# Altium project TeensySound.PrjPcb
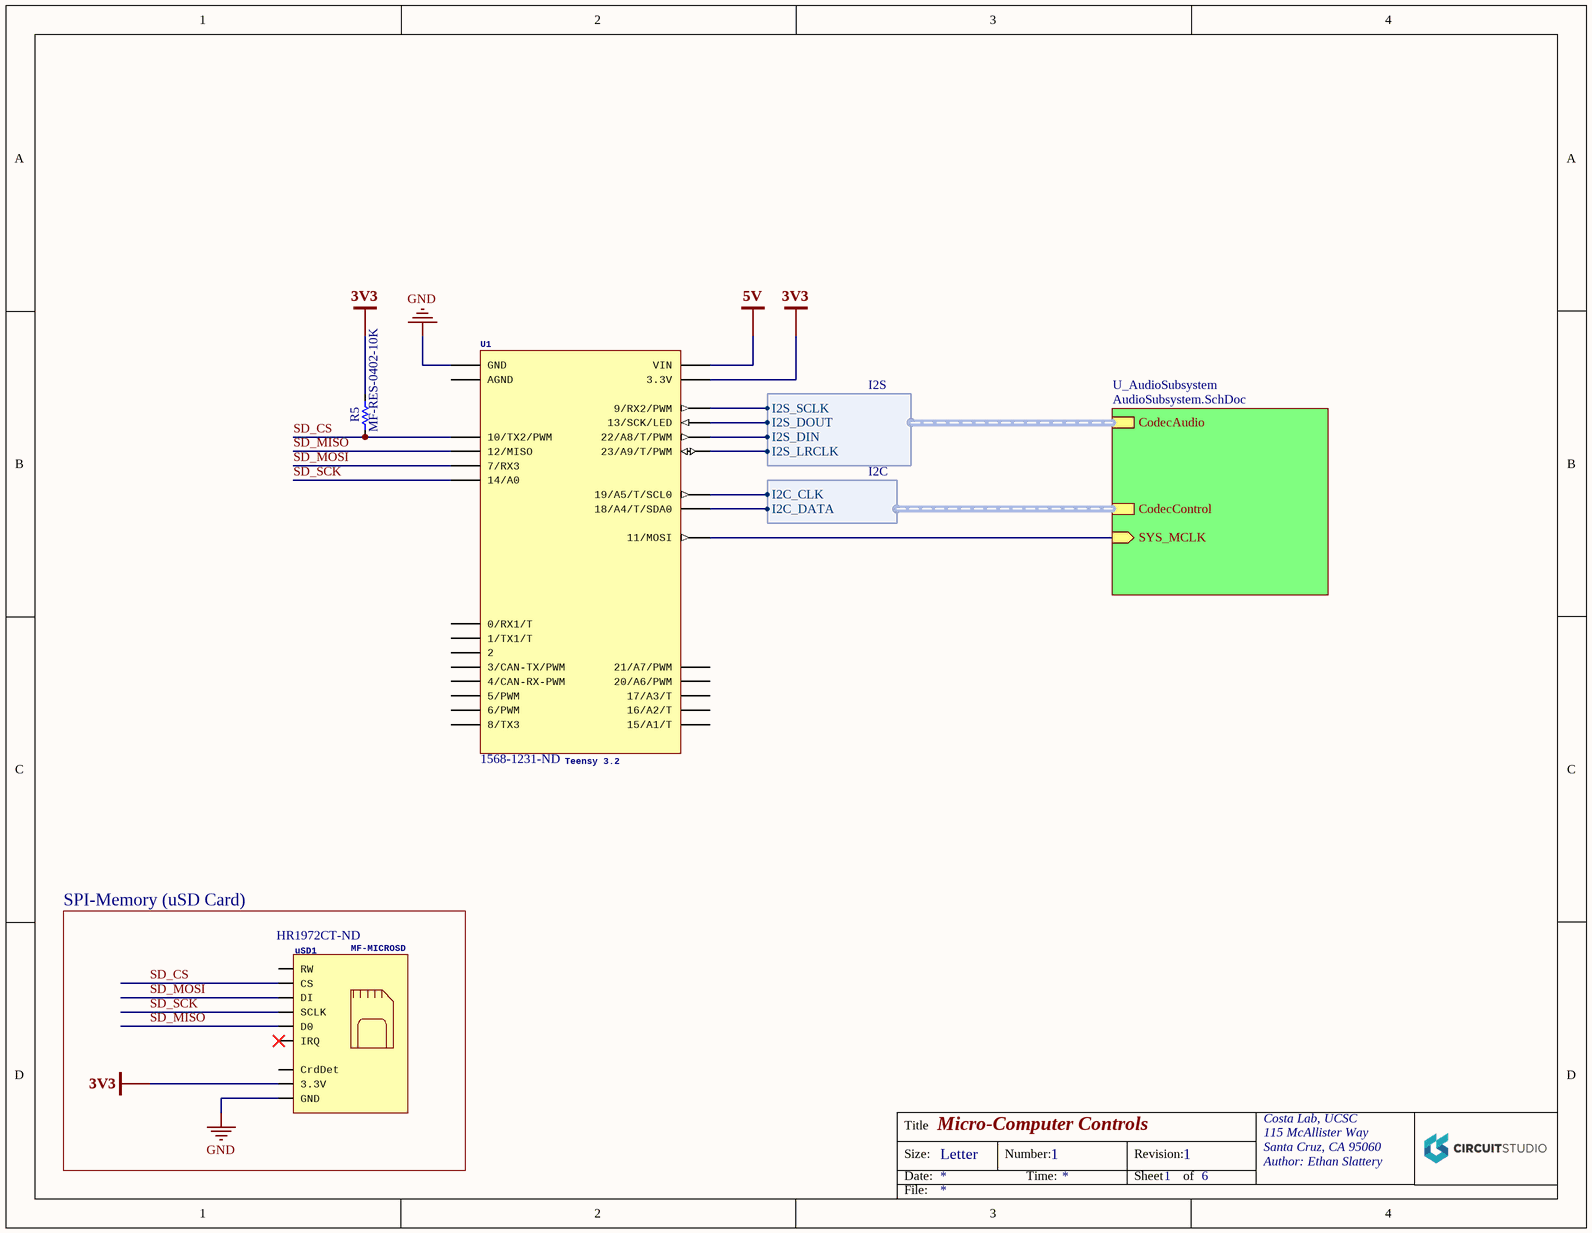
[diagram p0: Teensy32.SchDoc]
Address1: 115 McAllister Way; Address2: Santa Cruz, CA 95060; Address3: Author: Ethan Slattery; Author: Ethan Slattery; Organization: Costa Lab, UCSC
2 sheets, 24 parts. Net scope: hierarchical (ports join the sheet entries above them; power ports are global).
Sheets:
  Teensy32.SchDoc
    U_AudioSubsystem = AudioSubsystem.SchDoc

## Sheet Teensy32.SchDoc: Micro-Computer Controls
size Letter; Organization: Costa Lab, UCSC; Address1: 115 McAllister Way; Address2: Santa Cruz, CA 95060; Address3: Author: Ethan Slattery; DocumentNumber: 1; Revision: 1; SheetNumber: 1; SheetTotal: 6

### Parts
R5  MF-RES-0402-10K  [R0402L]
U1  Teensy 3.2  Supplier Part Number 1: 1568-1231-ND  [TEENSY_3.0-3.2&LC_DIL]
uSD1  MF-MICROSD  Supplier Part Number 1: HR1972CT-ND  [MF-MICROSD]

### Blocks framed on the sheet
SPI-Memory (uSD Card): uSD1

### Sub-sheets
U_AudioSubsystem = AudioSubsystem.SchDoc: CodecAudio (harness I2S), SYS_MCLK (in), CodecControl (harness I2C)

### Harnesses
I2S: I2S_DIN, I2S_DOUT, I2S_LRCLK, I2S_SCLK
I2C: I2C_CLK, I2C_DATA

### Nets
3V3: R5.2 U1.3.3V uSD1.3.3V
5V: U1.VIN
GND: U1.GND uSD1.GND
SD_CS: R5.1 U1.10(10/TX2/PWM) uSD1.2(CS)
SD_MISO: U1.12(12/MISO) uSD1.7(D0)
SD_MOSI: U1.7(7/RX3) uSD1.3(DI)
SD_SCK: U1.14/A0 uSD1.5(SCLK)
NetR3_1: U1.18/A4(18/A4/T/SDA0) ; sheet U_AudioSubsystem/CodecControl.I2C_DATA
NetR4_1: U1.19/A5(19/A5/T/SCL0) ; sheet U_AudioSubsystem/CodecControl.I2C_CLK
NetU1_9: U1.9(9/RX2/PWM) ; sheet U_AudioSubsystem/CodecAudio.I2S_SCLK
NetU1_11: U1.11(11/MOSI) ; sheet U_AudioSubsystem/SYS_MCLK
NetU1_13: U1.13(13/SCK/LED) ; sheet U_AudioSubsystem/CodecAudio.I2S_DOUT
NetU1_22/A8: U1.22/A8(22/A8/T/PWM) ; sheet U_AudioSubsystem/CodecAudio.I2S_DIN
NetU1_23/A9: U1.23/A9(23/A9/T/PWM) ; sheet U_AudioSubsystem/CodecAudio.I2S_LRCLK

Not connected (* = marked no-connect by the designer): U1 0(0/RX1/T) 1(1/TX1/T) 2 3(3/CAN-TX/PWM) 4(4/CAN-RX-PWM) 5(5/PWM) 6(6/PWM) 8(8/TX3) 15/A1(15/A1/T) 16/A2(16/A2/T) 17/A3(17/A3/T) 20/A6(20/A6/PWM) 21/A7(21/A7/PWM) AGND; uSD1 1(RW) 8(IRQ)* CrdDet

### Notes on the sheet
- Title
- Size:
- Date:
- Letter
- Number:
- Time:
- Revision:
- Sheet
- of
- File:

### Library data of the parts
R5 = RESISTOR: HOUSEPART: YES; POPULATE: 1; VOLTAGE: 50 V; WATTAGE: 100mW; VALUE: 1K; SymbolName_1: RESISTOR; LibraryName: MF_Passives; DeviceSetName: RESISTOR; MF_PARTNUM: MF-RES-0402-10K; Supplier 1: Digi-Key; Supplier Part Number 1: P1.0KJCT-ND
U1 = TEENSY 3.2: HOUSEPART: NO; Processor: MK20DX256VLH7; Clock Speed: 72MHz; Flash: 256 kb; RAM: 64 kb; DMA Channels: 4; USB: Yes; ADCs: 2; DeviceName: Teensy 3.2; URL: https://www.pjrc.com/teensy/teensy31.html; Supplier 1: Digi-Key
uSD1 = MacroFab uSD card slot: Actual Device is 4UCONN microSD; HOUSEPART: YES; SymbolName_1: SD_CARD; DeviceName: _MICRO_RIGHT; DeviceSetName: SD_CARD_SLOT; POPULATE: 1; MPN: MF-MICROSD; URL: https://factory.macrofab.com/part/MF-MICROSD; Supplier 1: Digi-Key

## Sheet AudioSubsystem.SchDoc: Audio Subsystem
size Letter; Organization: Costa Lab, UCSC; Address1: 115 McAllister Way; Address2: Santa Cruz, CA 95060; Address3: Author: Ethan Slattery; DocumentNumber: 4; Revision: 1; SheetNumber: 4; SheetTotal: 6
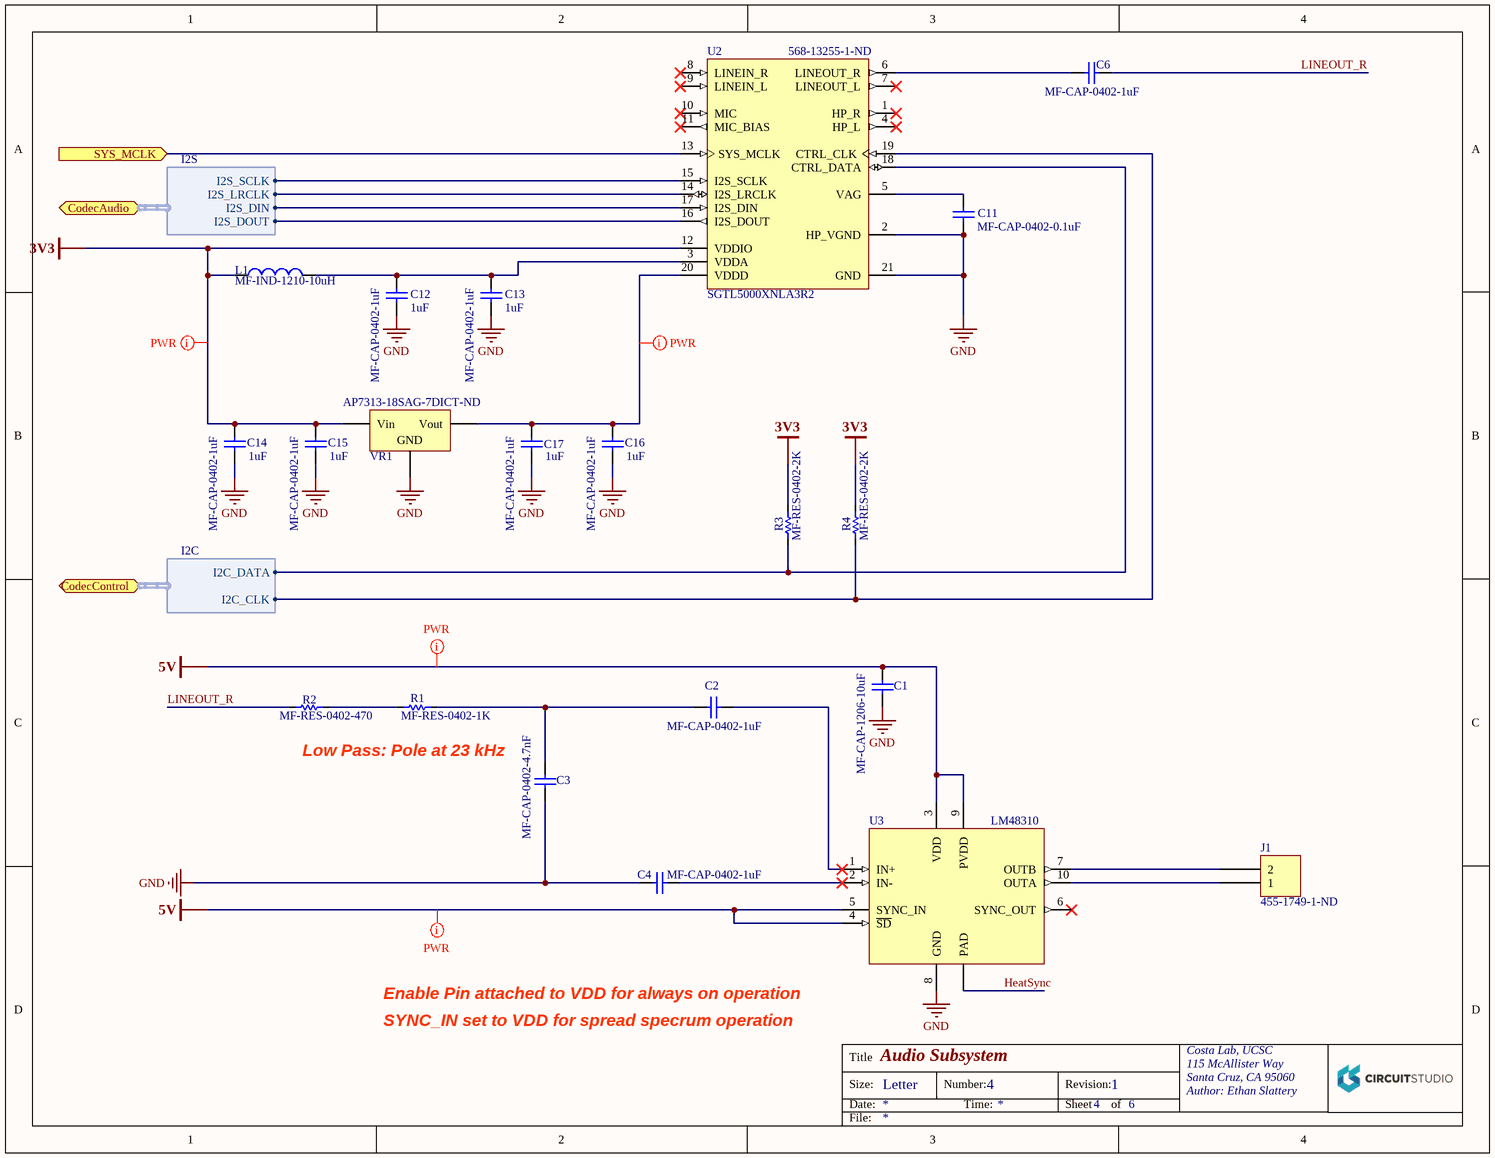
[diagram p1: AudioSubsystem.SchDoc]

### Parts
C1  MF-CAP-1206-10uF  [C1206L]
C2  MF-CAP-0402-1uF  [C0402N]
C3  MF-CAP-0402-4.7nF  [C0402L]
C4  MF-CAP-0402-1uF  [C0402N]
C6  MF-CAP-0402-1uF  [C0402N]
C11  MF-CAP-0402-0.1uF  [C0402N]
C12  MF-CAP-0402-1uF  Capacitance: 1uF  [C0402N]
C13  MF-CAP-0402-1uF  Capacitance: 1uF  [C0402N]
C14  MF-CAP-0402-1uF  Capacitance: 1uF  [C0402N]
C15  MF-CAP-0402-1uF  Capacitance: 1uF  [C0402N]
C16  MF-CAP-0402-1uF  Capacitance: 1uF  [C0402N]
C17  MF-CAP-0402-1uF  Capacitance: 1uF  [C0402N]
J1  455-1749-1-ND  [JST S2B-PH-SM4]
L1  MF-IND-1210-10uH  [L1210_N]
R1  MF-RES-0402-1K  [R0402L]
R2  MF-RES-0402-470  [R0402L]
R3  MF-RES-0402-2K  [R0402L]
R4  MF-RES-0402-2K  [R0402L]
U2  SGTL5000XNLA3R2  Supplier Part Number 1: 568-13255-1-ND  [FRES-2032-01_L]
U3  LM48310  [LM48310_l]
VR1  AP7313-18SAG-7DICT-ND  [AP7313_L]

### Ports
CodecAudio (harness I2S), CodecControl (harness I2C), SYS_MCLK (in)

### Harnesses
I2S: I2S_SCLK, I2S_LRCLK, I2S_DIN, I2S_DOUT
I2C: I2C_CLK, I2C_DATA

### Nets
3V3: C14.1 C15.1 L1.1 R3.2 R4.2 U2.12(VDDIO) VR1.1(Vin)
5V: C1.1 U3.3(VDD) U3.4(~{SD}) U3.5(SYNC_IN) U3.9(PVDD)
GND: C1.2 C3.1 C4.2 C11.2 C12.2 C13.2 C14.2 C15.2 C16.2 C17.2 U2.2(HP_VGND) U2.21(GND) U3.8(GND) VR1.3(GND)
HeatSync: U3.11(PAD)
LINEOUT_R: C6.1 R2.1
NetC2_1: C2.1 U3.1(IN+)
NetC2_2: C2.2 C3.2 R1.2
NetC4_1: C4.1 U3.2(IN-)
NetC6_2: C6.2 U2.6(LINEOUT_R)
NetC11_1: C11.1 U2.5(VAG)
NetC12_1: C12.1 C13.1 L1.2 U2.3(VDDA)
NetC16_1: C16.1 C17.1 U2.20(VDDD) VR1.2(Vout)
NetJ1_1: J1.1 U3.10(OUTA)
NetJ1_2: J1.2 U3.7(OUTB)
NetR1_1: R1.1 R2.2
NetR3_1: R3.1 U2.18(CTRL_DATA) ; port CodecControl.I2C_DATA
NetR4_1: R4.1 U2.19(CTRL_CLK) ; port CodecControl.I2C_CLK
NetU1_9: U2.15(I2S_SCLK) ; port CodecAudio.I2S_SCLK
NetU1_11: U2.13(SYS_MCLK) ; port SYS_MCLK
NetU1_13: U2.16(I2S_DOUT) ; port CodecAudio.I2S_DOUT
NetU1_22/A8: U2.17(I2S_DIN) ; port CodecAudio.I2S_DIN
NetU1_23/A9: U2.14(I2S_LRCLK) ; port CodecAudio.I2S_LRCLK

Not connected (* = marked no-connect by the designer): U2 1(HP_R)* 4(HP_L)* 7(LINEOUT_L)* 8(LINEIN_R)* 9(LINEIN_L)* 10(MIC)* 11(MIC_BIAS)*; U3 6(SYNC_OUT)*

### Layout directives
net class PWR: 3V3, 5V, NetC16_1

### Notes on the sheet
- Low Pass: Pole at 23 kHz
- Enable Pin attached to VDD for always on operation
- SYNC_IN set to VDD for spread specrum operation
- Title
- Size:
- Date:
- Letter
- Number:
- Time:
- Revision:
- Sheet
- of
- File:

### Library data of the parts
C1 = CAPACITOR_NP: HOUSEPART: YES; POPULATE: 1; TOLERANCE: 10%; VOLTAGE: 16V; VALUE: 10uF; LibraryName: MF_Passives; DeviceSetName: CAPACITOR_NP; MF_PARTNUM: MF-CAP-1206-10uF; Supplier 1: Digi-Key; Supplier Part Number 1: 445-1426-1-ND
C2 C4 C6 = CAPACITOR_NP: HOUSEPART: YES; POPULATE: 1; TOLERANCE: 10%; VOLTAGE: 16V; Capacitance: 1uF; LibraryName: MF_Passives; DeviceSetName: CAPACITOR_NP; MF_PARTNUM: MF-CAP-0402-1uF; Supplier 1: Digi-Key; Supplier Part Number 1: 490-10453-1-ND
C3 = CAPACITOR_NP: HOUSEPART: YES; POPULATE: 1; VALUE: 4.7nF; LibraryName: MF_Passives; DeviceSetName: CAPACITOR_NP; MF_PARTNUM: MF-CAP-0402-4.7nF; Supplier 1: Digi-Key; Supplier Part Number 1: 490-6313-1-ND
C11 = CAPACITOR_NP: HOUSEPART: YES; POPULATE: 1; TOLERANCE: 10%; VOLTAGE: 16V; Capacitance: 100nF; LibraryName: MF_Passives; DeviceSetName: CAPACITOR_NP; MF_PARTNUM: MF-CAP-0402-0.1uF; Supplier 1: Digi-Key; Supplier Part Number 1: 490-5415-1-ND
C12-C17 = CAPACITOR_NP: HOUSEPART: YES; POPULATE: 1; LibraryName: MF_Passives; DeviceSetName: CAPACITOR_NP; MF_PARTNUM: MF-CAP-0402-1uF; Supplier 1: Digi-Key; Supplier Part Number 1: 490-10453-1-ND
J1 = 2 Pin: HOUSEPART: NO; Supplier 1: Digi-Key; Supplier Part Number 1: 455-1749-1-ND
L1 = INDUCTOR: HOUSEPART: YES; POPULATE: 1; LibraryName: MF_Passives; DeviceSetName: INDUCTOR; MF_PARTNUM: MF-IND-1210-10uH; Supplier 1: Digi-Key; Supplier Part Number 1: 732-4670-1-ND
R1 = RESISTOR: as R5 on sheet Teensy32; SymbolName_1: RESISTOR; LibraryName: MF_Passives; DeviceSetName: RESISTOR; MF_PARTNUM: MF-RES-0402-1K; Supplier 1: Digi-Key; Supplier Part Number 1: P1.0KJCT-ND
R2 = RESISTOR: HOUSEPART: YES; POPULATE: 1; TOLERANCE: 5%; VOLTAGE: 50V; WATTAGE: 100mW; SymbolName_1: RESISTOR; LibraryName: MF_Passives; DeviceSetName: RESISTOR; MF_PARTNUM: MF-RES-0402-470; Supplier 1: Digi-Key; Supplier Part Number 1: P470JCT-ND
R3 R4 = RESISTOR: =MF_PARTNUM; HOUSEPART: YES; POPULATE: 1; VOLTAGE: 50 V; WATTAGE: 100mW; VALUE: 1K; SymbolName_1: RESISTOR; LibraryName: MF_Passives; DeviceSetName: RESISTOR; MF_PARTNUM: MF-RES-0402-2K; Supplier 1: Digi-Key; Supplier Part Number 1: P1.0KJCT-ND
U2 = CMP-1078-00004-1: Low Power Stereo Codec with Headphone Amp, 1.1 to 2 V, -40 to 85 degC, 20-Pin QFN-EP, RoHS, Tape and Reel; Manufacturer: Freescale Semiconductor; HOUSEPART: NO; SYS_MCLK Rise/Fall Time: 0.5 to 10 ns; VDDD(V): 1.1 to 2; LINEOUT Output Impedance: 320 Ohm Typ.; VDDIO(V): 1.62 to 3.6; MIC Input Impedance: 2.9 KOhm Typ.; ComponentLink1Description: Manufacturer URL; ComponentLink2Description: Datasheet; Temperature Range: -40 to 85 degC; PartNumber: SGTL5000XNLA3R2; ComponentLink2URL: http://cache.freescale.com/files/analog/doc/data_sheet/SGTL5000.pdf?pspll=1&Parent_nodeId=1227651963351723867067&Parent_pageType=product; RoHS: TRUE; ComponentLink3URL: http://cache.freescale.com/files/shared/doc/package_info/98ARE10742D.pdf?&Parent_nodeId=&Parent_pageType=; ComponentLink1URL: http://www.freescale.com/; Mounting Technology: Surface Mount; ComponentLink3Description: Package Specification; PackageDescription: 20-Pin Thermally Enhanced Quad Flat Non-Lead Package(QFN), Body 3 x 3 mm, Pitch 0.4 mm; Packing: Tape and Reel; DatasheetVersion: Rev. 6.0; PackageVersion: Rev. O; PackageReference: 2032-01; Supplier 1: Digi-Key
VR1 = Volt Reg: Voltage Regulator; HOUSEPART: NO; Input Voltage: 2V to 6V; Output Voltage: 1V to 3.3V Fixed; Startup Time: 80uS; Current - Output: 150mA; Dropout Voltage: 150mV; Current - Quiescent (Iq): 75µA; PSRR: 65dB (100Hz); Protection Features: Over Current, Over Temperature, Short Circuit; PackageDescription: 3-Pin Transistor Outline Package 2.54 mm Pitch, 15.1 mm Lead Span; Package: SOT23; Operating Temperature: -40°C ~ 85°C; Supplier 1: Digi-Key; Supplier Part Number 1: AP7313-18SAG-7DICT-ND

## Nets that join several sheets
3V3: Teensy32 (R5.2 U1.3.3V uSD1.3.3V), AudioSubsystem (7 pins)
5V: Teensy32 (U1.VIN), AudioSubsystem (5 pins)
GND: Teensy32 (U1.GND uSD1.GND), AudioSubsystem (14 pins)
NetR3_1: Teensy32 (U1.18/A4), AudioSubsystem (R3.1 U2.18)
NetR4_1: Teensy32 (U1.19/A5), AudioSubsystem (R4.1 U2.19)
NetU1_9: Teensy32 (U1.9), AudioSubsystem (U2.15)
NetU1_11: Teensy32 (U1.11), AudioSubsystem (U2.13)
NetU1_13: Teensy32 (U1.13), AudioSubsystem (U2.16)
NetU1_22/A8: Teensy32 (U1.22/A8), AudioSubsystem (U2.17)
NetU1_23/A9: Teensy32 (U1.23/A9), AudioSubsystem (U2.14)